# Altium schematic sheet AD.schdoc
size 354 x 222 mm
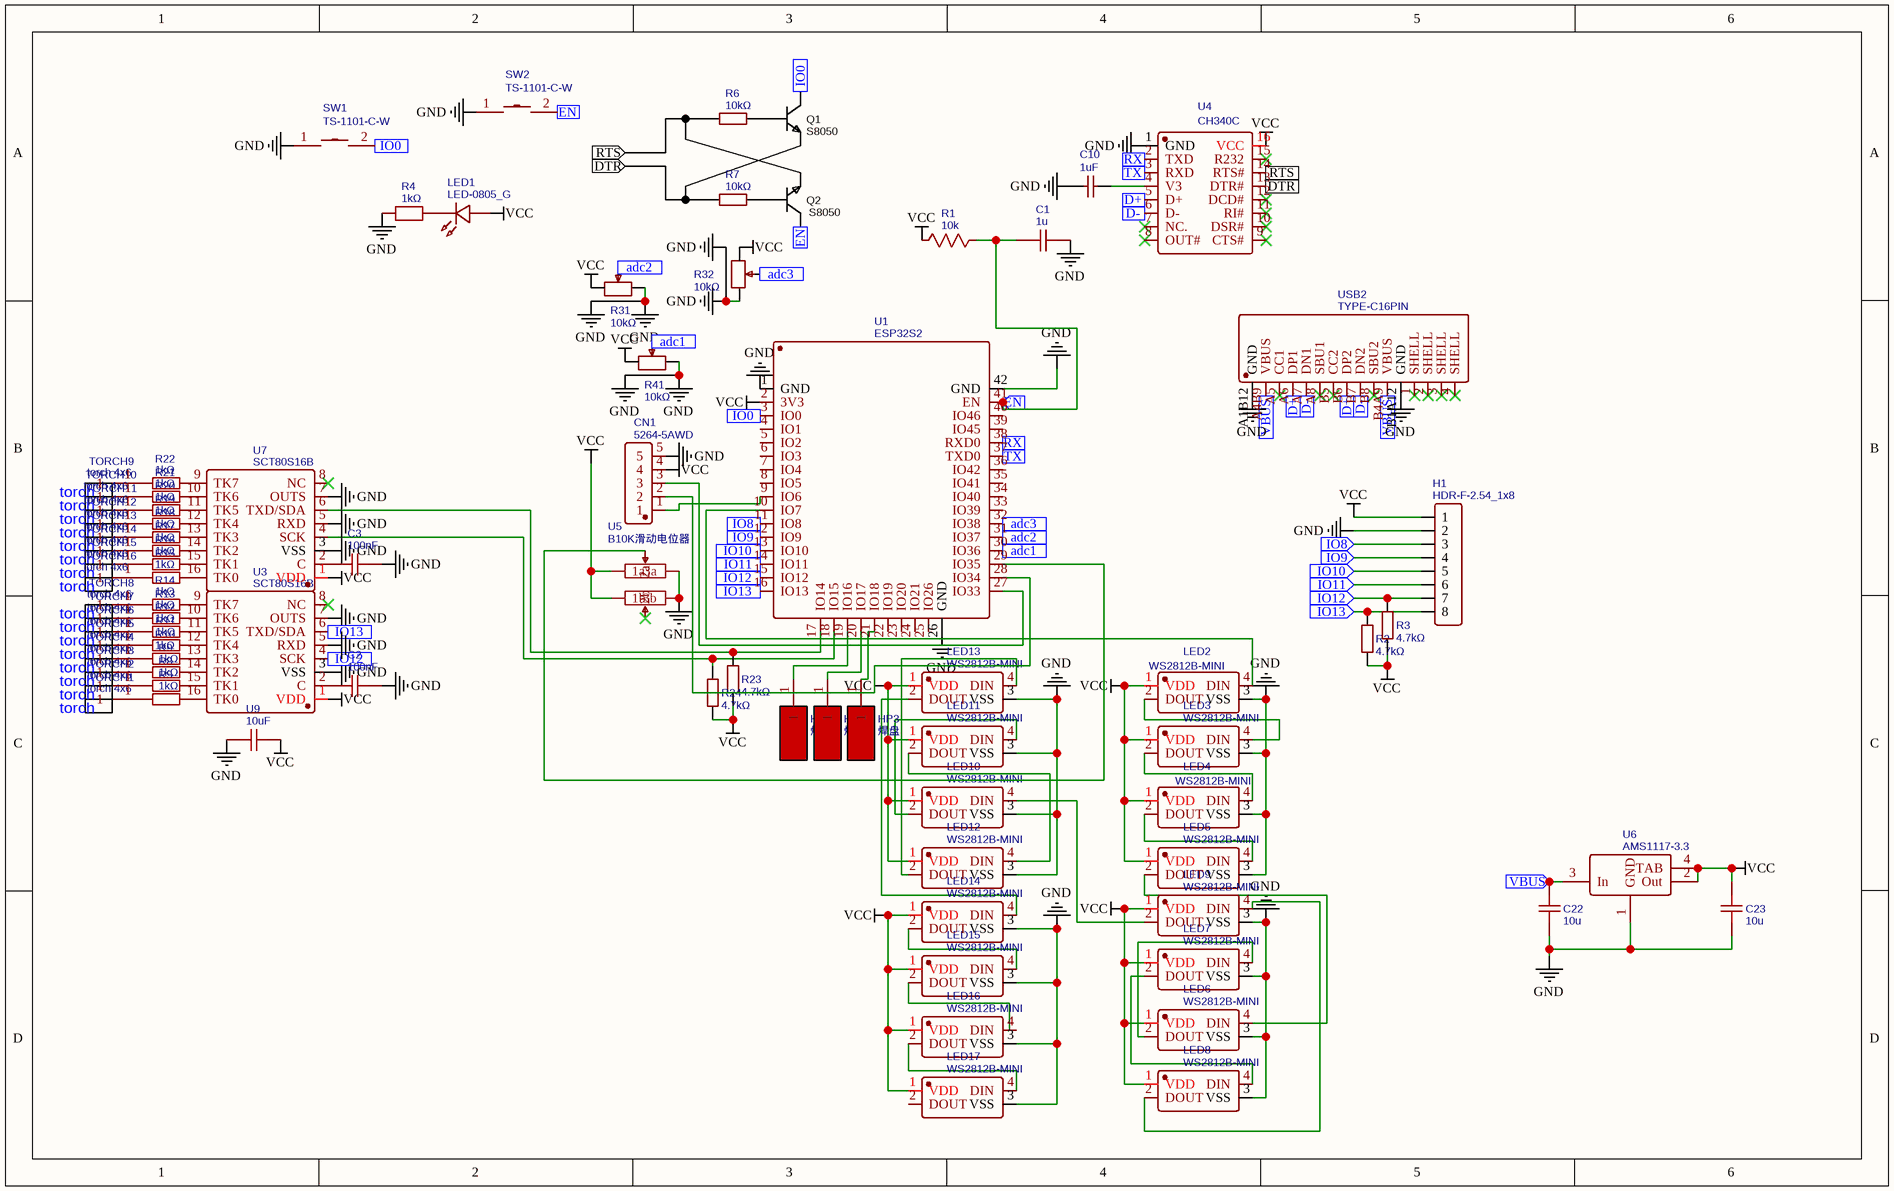
[diagram p0: AD.schdoc]

## Parts
C1  1u  [C0603]
C2  100nF  [C0805]
C3  100nF  [C0805]
C10  1uF  [C0805]
C22  10u  [C1206]
C23  10u  [C1206]
CN1  5264-5AWD  [CONN-TH_5P-P2.50_5264-5AWD]
H1  HDR-F-2.54_1x8  [HDR-F-2.54_1X8]
HP1  焊盘  [焊盘]
HP2  焊盘  [焊盘]
HP3  焊盘  [焊盘]
LED1  LED-0805_G  [LED0805_GREEN]
LED2  WS2812B-MINI  [LED-SMD_4P-L3.5-W3.5-TL_WS2812B]
LED3  WS2812B-MINI  [LED-SMD_4P-L3.5-W3.5-TL_WS2812B]
LED4  WS2812B-MINI  [LED-SMD_4P-L3.5-W3.5-TL_WS2812B]
LED5  WS2812B-MINI  [LED-SMD_4P-L3.5-W3.5-TL_WS2812B]
LED6  WS2812B-MINI  [LED-SMD_4P-L3.5-W3.5-TL_WS2812B]
LED7  WS2812B-MINI  [LED-SMD_4P-L3.5-W3.5-TL_WS2812B]
LED8  WS2812B-MINI  [LED-SMD_4P-L3.5-W3.5-TL_WS2812B]
LED9  WS2812B-MINI  [LED-SMD_4P-L3.5-W3.5-TL_WS2812B]
LED10  WS2812B-MINI  [LED-SMD_4P-L3.5-W3.5-TL_WS2812B]
LED11  WS2812B-MINI  [LED-SMD_4P-L3.5-W3.5-TL_WS2812B]
LED12  WS2812B-MINI  [LED-SMD_4P-L3.5-W3.5-TL_WS2812B]
LED13  WS2812B-MINI  [LED-SMD_4P-L3.5-W3.5-TL_WS2812B]
LED14  WS2812B-MINI  [LED-SMD_4P-L3.5-W3.5-TL_WS2812B]
LED15  WS2812B-MINI  [LED-SMD_4P-L3.5-W3.5-TL_WS2812B]
LED16  WS2812B-MINI  [LED-SMD_4P-L3.5-W3.5-TL_WS2812B]
LED17  WS2812B-MINI  [LED-SMD_4P-L3.5-W3.5-TL_WS2812B]
Q1  S8050  [SOT-23-3_L2.9-W1.3-P1.90-LS2.4-BR]
Q2  S8050  [SOT-23-3_L2.9-W1.3-P1.90-LS2.4-BR]
R1  10k  [R0603]
R2  4.7kΩ  [R0805]
R3  4.7kΩ  [R0805]
R4  1kΩ  [R0805]
R5  1kΩ  [R0603]
R6  10kΩ  [R0805]
R7  10kΩ  [R0805]
R8  1kΩ  [R0603]
R9  1kΩ  [R0603]
R10  1kΩ  [R0603]
R11  1kΩ  [R0603]
R12  1kΩ  [R0603]
R13  1kΩ  [R0603]
R14  1kΩ  [R0603]
R15  1kΩ  [R0603]
R16  1kΩ  [R0603]
R17  1kΩ  [R0603]
R18  1kΩ  [R0603]
R19  1kΩ  [R0603]
R20  1kΩ  [R0603]
R21  1kΩ  [R0603]
R22  1kΩ  [R0603]
R23  4.7kΩ  [R0805]
R24  4.7kΩ  [R0805]
R31  10kΩ  [RES-ADJ-TH_RK09K1130AJ3]
R32  10kΩ  [RES-ADJ-TH_RK09K1130AJ3]
R41  10kΩ  [RES-ADJ-TH_RK09K1130AJ3]
SW1  TS-1101-C-W  [SW-SMD_L6.0-W3.3-LS8.0]
SW2  TS-1101-C-W  [SW-SMD_L6.0-W3.3-LS8.0]
TORCH1  torch 4x6  [?单面焊盘]
TORCH2  torch 4x6  [?单面焊盘]
TORCH3  torch 4x6  [?单面焊盘]
TORCH4  torch 4x6  [?单面焊盘]
TORCH5  torch 4x6  [?单面焊盘]
TORCH6  torch 4x6  [?单面焊盘]
TORCH7  torch 4x6  [?单面焊盘]
TORCH8  torch 4x6  [?单面焊盘]
TORCH9  torch 4x6  [?单面焊盘]
TORCH10  torch 4x6  [?单面焊盘]
TORCH11  torch 4x6  [?单面焊盘]
TORCH12  torch 4x6  [?单面焊盘]
TORCH13  torch 4x6  [?单面焊盘]
TORCH14  torch 4x6  [?单面焊盘]
TORCH15  torch 4x6  [?单面焊盘]
TORCH16  torch 4x6  [?单面焊盘]
U1  ESP32S2  [ESP32S2]
U3  SCT80S16B  [SOP-16_L10.0-W3.9-P1.27-LS6.0-BL]
U4  CH340C  [SOP-16_L10.0-W3.9-P1.27-LS6.0-BL]
U5  B10K滑动电位器  [B10K]
U6  AMS1117-3.3  [AM1117]
U7  SCT80S16B  [SOP-16_L10.0-W3.9-P1.27-LS6.0-BL]
U9  10uF  [C1206]
USB2  TYPE-C16PIN  [USB-C-SMD_TYPE-C16PIN]

## Ports
adc1 (in), adc2 (in), adc3 (in), D+ (in), D- (in), DTR (in), EN (in), IO0 (in), IO8 (in), IO9 (in), IO10 (in), IO11 (in), IO12 (in), IO13 (in), RTS (in), RX (in), TX (in), VBUS (in)

## Nets
GND: C1.2 C2.2 C3.2 C10.2 C22.1 C23.1 CN1.5 H1.2 LED2.3(VSS) LED3.3(VSS) LED4.3(VSS) LED5.3(VSS) LED6.3(VSS) LED7.3(VSS) LED8.3(VSS) LED9.3(VSS) LED10.3(VSS) LED11.3(VSS) LED12.3(VSS) LED13.3(VSS) LED14.3(VSS) LED15.3(VSS) LED16.3(VSS) LED17.3(VSS) R4.1 R31.1 R31.4 R31.5 R32.1 R32.4 R32.5 R41.1 R41.4 R41.5 SW1.1 SW2.1 U1.1(GND) U1.26(GND) U1.42(GND) U3.3(VSS) U3.5(RXD) U3.7(OUTS) U4.1(GND) U5.3a U5.3b U6.1(GND) U7.3(VSS) U7.5(RXD) U7.7(OUTS) U9.1 USB2.A1B12(GND) USB2.B1A12(GND)
VCC: C23.2 CN1.4 H1.1 LED1.1 LED2.1(VDD) LED3.1(VDD) LED4.1(VDD) LED5.1(VDD) LED6.1(VDD) LED7.1(VDD) LED8.1(VDD) LED9.1(VDD) LED10.1(VDD) LED11.1(VDD) LED12.1(VDD) LED13.1(VDD) LED14.1(VDD) LED15.1(VDD) LED16.1(VDD) LED17.1(VDD) R1.1 R2.1 R3.1 R23.1 R24.1 R31.3 R32.3 R41.3 U1.2(3V3) U3.1(VDD) U4.16(VCC) U5.1a U5.1b U6.2(Out) U6.4(TAB) U7.1(VDD) U9.2
adc1: R41.2 U1.30(IO36) ; port adc1
adc2: R31.2 U1.31(IO37) ; port adc2
adc3: R32.2 U1.32(IO38) ; port adc3
D+: U4.5(D+) USB2.A6(DP1) USB2.B6(DP2) ; port D+
D-: U4.6(D-) USB2.A7(DN1) USB2.B7(DN2) ; port D-
DTR: Q1.2(E) R7.1 U4.13(DTR#) ; port DTR
EN: C1.1 Q2.3(C) R1.2 SW2.2 U1.41(EN) ; port EN
IO0: Q1.3(C) SW1.2 U1.3(IO0) ; port IO0
IO8: H1.3 U1.11(IO8) ; port IO8
IO9: H1.4 U1.12(IO9) ; port IO9
IO10: H1.5 U1.13(IO10) ; port IO10
IO11: H1.6 U1.14(IO11) ; port IO11
IO12: H1.7 R3.2 U1.15(IO12) U3.4(SCK) ; port IO12
IO13: H1.8 R2.2 U1.16(IO13) U3.6(TXD/SDA) ; port IO13
RTS: Q2.2(E) R6.1 U4.14(RTS#) ; port RTS
RX: U1.38(RXD0) U4.2(TXD) ; port RX
TX: U1.37(TXD0) U4.3(RXD) ; port TX
VBUS: C22.2 U6.3(In) USB2.A4B9(VBUS) USB2.B4A9(VBUS) ; port VBUS
NetC2_1: C2.1 U3.2(C)
NetC3_1: C3.1 U7.2(C)
NetC10_1: C10.1 U4.4(V3)
NetCN1_1: CN1.1 U1.9(IO6)
NetCN1_2: CN1.2 U1.28(IO34)
NetCN1_3: CN1.3 U1.27(IO33)
NetHP1_1: HP1.1 U1.19(IO16)
NetHP2_1: HP2.1 U1.20(IO17)
NetHP3_1: HP3.1 U1.21(IO18)
NetLED1_2: LED1.2 R4.2
NetLED2_2: LED2.2(DOUT) LED3.4(DIN)
NetLED2_4: LED2.4(DIN) U1.10(IO7)
NetLED3_2: LED3.2(DOUT) LED4.4(DIN)
NetLED4_2: LED4.2(DOUT) LED5.4(DIN)
NetLED5_2: LED5.2(DOUT) LED6.4(DIN)
NetLED6_2: LED6.2(DOUT) LED7.4(DIN)
NetLED7_2: LED7.2(DOUT) LED8.4(DIN)
NetLED8_2: LED8.2(DOUT) LED9.4(DIN)
NetLED9_2: LED9.2(DOUT) LED10.4(DIN)
NetLED10_2: LED10.2(DOUT) LED11.4(DIN)
NetLED11_2: LED11.2(DOUT) LED12.4(DIN)
NetLED12_2: LED12.2(DOUT) LED13.4(DIN)
NetLED13_2: LED13.2(DOUT) LED14.4(DIN)
NetLED14_2: LED14.2(DOUT) LED15.4(DIN)
NetLED15_2: LED15.2(DOUT) LED16.4(DIN)
NetLED16_2: LED16.2(DOUT) LED17.4(DIN)
NetQ1_1: Q1.1(B) R6.2
NetQ2_1: Q2.1(B) R7.2
NetR5_1: R5.1 U3.16(TK0)
NetR5_2: R5.2 TORCH1.1
NetR8_1: R8.1 U3.15(TK1)
NetR8_2: R8.2 TORCH2.1
NetR9_1: R9.1 U3.14(TK2)
NetR9_2: R9.2 TORCH3.1
NetR10_1: R10.1 U3.13(TK3)
NetR10_2: R10.2 TORCH4.1
NetR11_1: R11.1 U3.12(TK4)
NetR11_2: R11.2 TORCH5.1
NetR12_1: R12.1 U3.11(TK5)
NetR12_2: R12.2 TORCH6.1
NetR13_1: R13.1 U3.10(TK6)
NetR13_2: R13.2 TORCH7.1
NetR14_1: R14.1 U3.9(TK7)
NetR14_2: R14.2 TORCH8.1
NetR15_1: R15.1 U7.16(TK0)
NetR15_2: R15.2 TORCH16.1
NetR16_1: R16.1 U7.15(TK1)
NetR16_2: R16.2 TORCH15.1
NetR17_1: R17.1 U7.14(TK2)
NetR17_2: R17.2 TORCH14.1
NetR18_1: R18.1 U7.13(TK3)
NetR18_2: R18.2 TORCH13.1
NetR19_1: R19.1 U7.12(TK4)
NetR19_2: R19.2 TORCH12.1
NetR20_1: R20.1 U7.11(TK5)
NetR20_2: R20.2 TORCH11.1
NetR21_1: R21.1 U7.10(TK6)
NetR21_2: R21.2 TORCH10.1
NetR22_1: R22.1 U7.9(TK7)
NetR22_2: R22.2 TORCH9.1
NetR23_2: R23.2 U1.17(IO14) U7.6(TXD/SDA)
NetR24_2: R24.2 U1.18(IO15) U7.4(SCK)
NetU1_29: U1.29(IO35) U5.2a

Not connected (* = marked no-connect by the designer): LED17 2(DOUT); U1 4(IO1) 5(IO2) 6(IO3) 7(IO4) 8(IO5) 22(IO19) 23(IO20) 24(IO21) 25(IO26) 33(IO39) 34(IO40) 35(IO41) 36(IO42) 39(IO45) 40(IO46); U3 8(NC)*; U4 7(NC.)* 8(OUT#)* 9(CTS#)* 10(DSR#)* 11(RI#)* 12(DCD#)* 15(R232)*; U5 2b*; U7 8(NC)*; USB2 1(SHELL)* 2(SHELL)* 3(SHELL)* 4(SHELL)* A5(CC1)* A8(SBU1)* B5(CC2)* B8(SBU2)*

## Notes on the sheet
- (in symbol torch 4x6) torch

## Library data of the parts
C1 = 1u: nameAlias: Value(F); Contributor: LCEDA_Lib; spicePre: C; spiceSymbolName: C_0603_US
C2 C3 = 100nF: Manufacturer: KEMET(基美); Manufacturer Part: C0805X104K1RACAUTO; nameAlias: Value; Contributor: LCSC; Supplier: LCSC; Supplier Part: C561838; JLCPCB Part Class: Extended Part; spicePre: C; spiceSymbolName: C0805X104K1RACAUTO
C10 = 1uF: Manufacturer: muRata(村田); Manufacturer Part: GRM21BR61E226ME44L; nameAlias: Value; Supplier: LCSC; Supplier Part: C86816; spicePre: C; spiceSymbolName: GRM21BR61E226ME44L; JLCPCB Part Class: Extended Part
C22 C23 = 10u: nameAlias: Value(F); Manufacturer Part: ?; spicePre: C; spiceSymbolName: Cap_RAD-0.1_US
CN1 = 5264-5AWD: Manufacturer: BOOMELE(博穆精密); Manufacturer Part: 5264-5AWD米色; Contributor: LCSC; Supplier: LCSC; Supplier Part: C176652; JLCPCB Part Class: Extended Part; spicePre: C; spiceSymbolName: 5264-5AWD
H1 = HDR-F-2.54_1x8: Contributor: LCEDA_Lib; Supplier Part: C225505; Supplier: LCSC; spicePre: H; spiceSymbolName: HDR-F-2.54_1x8
HP1-HP3 = 焊盘: Manufacturer: .....; Contributor: killjsjzhang; Manufacturer Part: .....; Supplier Part: .....; link: .....; spicePre: H; spiceSymbolName: 焊盘
LED1 = LED-0805_G: Manufacturer: 国星光电; Manufacturer Part: NCD0805G1; Contributor: LCEDA_Lib; Supplier Part: C84260; spicePre: L; spiceSymbolName: LED-0805_G
LED2-LED17 = WS2812B-MINI: Manufacturer: worldsemi; Manufacturer Part: WS2812B-MINI-V3/W; Contributor: LCSC; Supplier: LCSC; Supplier Part: C527089; JLCPCB Part Class: Extended Part; spicePre: L; spiceSymbolName: WS2812B-MINI
Q1 Q2 = S8050: Manufacturer: Yenji; Contributor: 立创EDA官方封装库; SMT Type: Extend; Supplier: LCSC; Manufacturer Part: S8050; Supplier Part: C139514; LCSC Assembly: Yes; spicePre: Q; spiceSymbolName: S8050-C139514
R1 = 10k: nameAlias: Value(Ω); Contributor: LCEDA_Lib; spicePre: R; spiceSymbolName: R_0603_US
R2 R3 R23 R24 = 4.7kΩ: Manufacturer: UNI-ROYAL(厚声); Manufacturer Part: 0805W8F4701T5E; nameAlias: Value; Supplier: LCSC; Supplier Part: C17673; JLCPCB Part Class: Basic Part; spicePre: R; spiceSymbolName: 0805W8F4701T5E
R4 = 1kΩ: Manufacturer: UNI-ROYAL(厚声); Manufacturer Part: 0805W8D1001T5E; nameAlias: Value; Contributor: LCSC; Supplier: LCSC; Supplier Part: C2767302; JLCPCB Part Class: Extended Part; spicePre: R; spiceSymbolName: 0805W8D1001T5E
R5 R8-R22 = 1kΩ: Manufacturer: PANASONIC(松下); Manufacturer Part: ERJ3RBD1001V; nameAlias: Value; Contributor: LCSC; Supplier: LCSC; Supplier Part: C336844; JLCPCB Part Class: Extended Part; spicePre: R; spiceSymbolName: ERJ3RBD1001V
R6 R7 = 10kΩ: Manufacturer: UNI-ROYAL(厚声); Manufacturer Part: 0805W8F1002T5E; nameAlias: Value; Supplier: LCSC; Supplier Part: C17414; JLCPCB Part Class: Basic Part; spicePre: R; spiceSymbolName: 0805W8F1002T5E
R31 R32 R41 = 10kΩ: Manufacturer: ALPSALPINE(阿尔卑斯阿尔派); Manufacturer Part: RK09K1130AP5; nameAlias: Value; Contributor: lcsc; Supplier: LCSC; Supplier Part: C470295; JLCPCB Part Class: Extended Part; spicePre: R; spiceSymbolName: RK09K1130AP5
SW1 SW2 = TS-1101-C-W: Manufacturer: XKB Connectivity(中国星坤); Contributor: LCSC; Supplier: LCSC; Supplier Part: C318938; Manufacturer Part: TS-1101-C-W; JLCPCB Part Class: Extended Part; spicePre: S; spiceSymbolName: TS-1101-C-W
TORCH1-TORCH16 = torch 4x6: Contributor: killjsjzhang; spicePre: T; spiceSymbolName: torch 4x6
U1 = ESP32S2: Manufacturer: ESPRESSIF(乐鑫); Manufacturer Part: ESP32-S2-WROVER-I-N8R2; Contributor: blue.love; Supplier: LCSC; Supplier Part: C2973654; spicePre: U; spiceSymbolName: ESP32S2
U3 U7 = SCT80S16B: Manufacturer: SOC(赛元); Contributor: LCSC; Supplier: LCSC; Supplier Part: C367201; Manufacturer Part: SCT80S16B; JLCPCB Part Class: Extended Part; spicePre: U; spiceSymbolName: SCT80S16B
U4 = CH340C: Manufacturer: WCH(南京沁恒); Supplier: LCSC; Manufacturer Part: CH340C; Supplier Part: C84681; JLCPCB Part Class: Extended Part; spicePre: U; spiceSymbolName: CH340C
U5 = B10K滑动电位器: Contributor: 梦之精灵影像设计协会; spicePre: U; spiceSymbolName: B10K滑动电位器
U6 = AMS1117-3.3: Manufacturer: AMS; sourceId: dwIGgezVh; timeStamp: 1476261164; Supplier: LCSC; Manufacturer Part: AMS1117-3.3; LCSC Assembly: Yes; image: //image.lceda.cn/szlcsc/C6186.jpg; Supplier Part: C6186; spicePre: U
U9 = 10uF: Manufacturer: SAMWHA(三和); Manufacturer Part: CS3216Y5V106Z350NRI; Contributor: lcsc; nameAlias: Value; Supplier: LCSC; Supplier Part: C2918487; JLCPCB Part Class: Extended Part; spicePre: U; spiceSymbolName: CS3216Y5V106Z350NRI
USB2 = TYPE-C16PIN: Manufacturer: SHOU HAN(首韩); Contributor: LCSC; Supplier: LCSC; Supplier Part: C393939; Manufacturer Part: TYPE-C16PIN; JLCPCB Part Class: Extended Part; spicePre: U; spiceSymbolName: TYPE-C16PIN